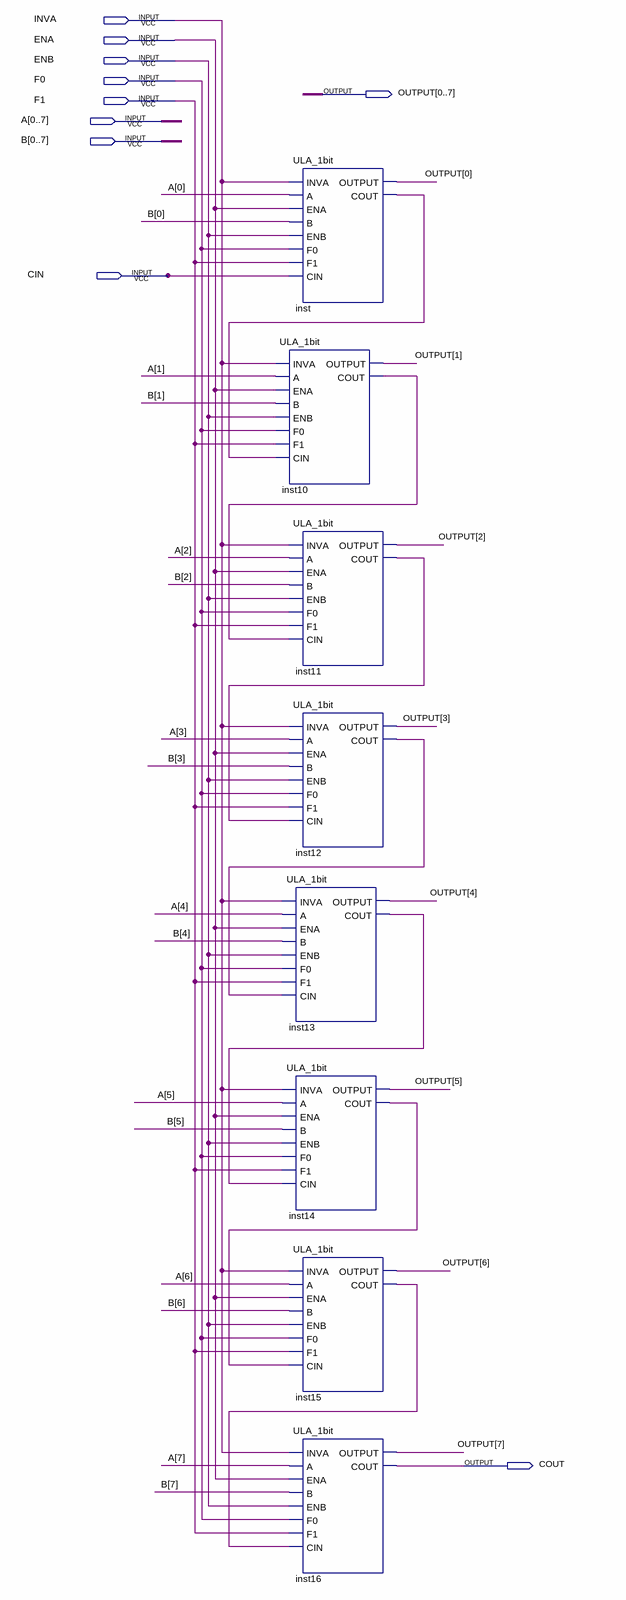
[diagram p0: schematic sheet]
// Quartus schematic ULA_8bits.bdf as structural Verilog: 8 symbols, 10 pins
module ULA_8bits (
  input  INVA,
  input  ENA,
  input  ENB,
  input  F0,
  input  F1,
  input  [0:7] A,
  input  [0:7] B,
  input  CIN,
  output [0:7] OUTPUT,
  output COUT
);

  wire inst10_cout, inst11_cout, inst12_cout, inst13_cout, inst14_cout, inst15_cout, inst_cout;

  ULA_1bit inst (
    .INVA(INVA), .A(A[0]), .ENA(ENA), .B(B[0]), .ENB(ENB), .F0(F0), .F1(F1), .CIN(CIN), .OUTPUT(OUTPUT[0]),
    .COUT(inst_cout));
  ULA_1bit inst10 (
    .INVA(INVA), .A(A[1]), .ENA(ENA), .B(B[1]), .ENB(ENB), .F0(F0), .F1(F1), .CIN(inst_cout),
    .OUTPUT(OUTPUT[1]), .COUT(inst10_cout));
  ULA_1bit inst11 (
    .INVA(INVA), .A(A[2]), .ENA(ENA), .B(B[2]), .ENB(ENB), .F0(F0), .F1(F1), .CIN(inst10_cout),
    .OUTPUT(OUTPUT[2]), .COUT(inst11_cout));
  ULA_1bit inst12 (
    .INVA(INVA), .A(A[3]), .ENA(ENA), .B(B[3]), .ENB(ENB), .F0(F0), .F1(F1), .CIN(inst11_cout),
    .OUTPUT(OUTPUT[3]), .COUT(inst12_cout));
  ULA_1bit inst13 (
    .INVA(INVA), .A(A[4]), .ENA(ENA), .B(B[4]), .ENB(ENB), .F0(F0), .F1(F1), .CIN(inst12_cout),
    .OUTPUT(OUTPUT[4]), .COUT(inst13_cout));
  ULA_1bit inst14 (
    .INVA(INVA), .A(A[5]), .ENA(ENA), .B(B[5]), .ENB(ENB), .F0(F0), .F1(F1), .CIN(inst13_cout),
    .OUTPUT(OUTPUT[5]), .COUT(inst14_cout));
  ULA_1bit inst15 (
    .INVA(INVA), .A(A[6]), .ENA(ENA), .B(B[6]), .ENB(ENB), .F0(F0), .F1(F1), .CIN(inst14_cout),
    .OUTPUT(OUTPUT[6]), .COUT(inst15_cout));
  ULA_1bit inst16 (
    .INVA(INVA), .A(A[7]), .ENA(ENA), .B(B[7]), .ENB(ENB), .F0(F0), .F1(F1), .CIN(inst15_cout),
    .OUTPUT(OUTPUT[7]), .COUT(COUT));
endmodule
